# EAGLE schematic touch-board-ks-edition (EAGLE 6.5.0)
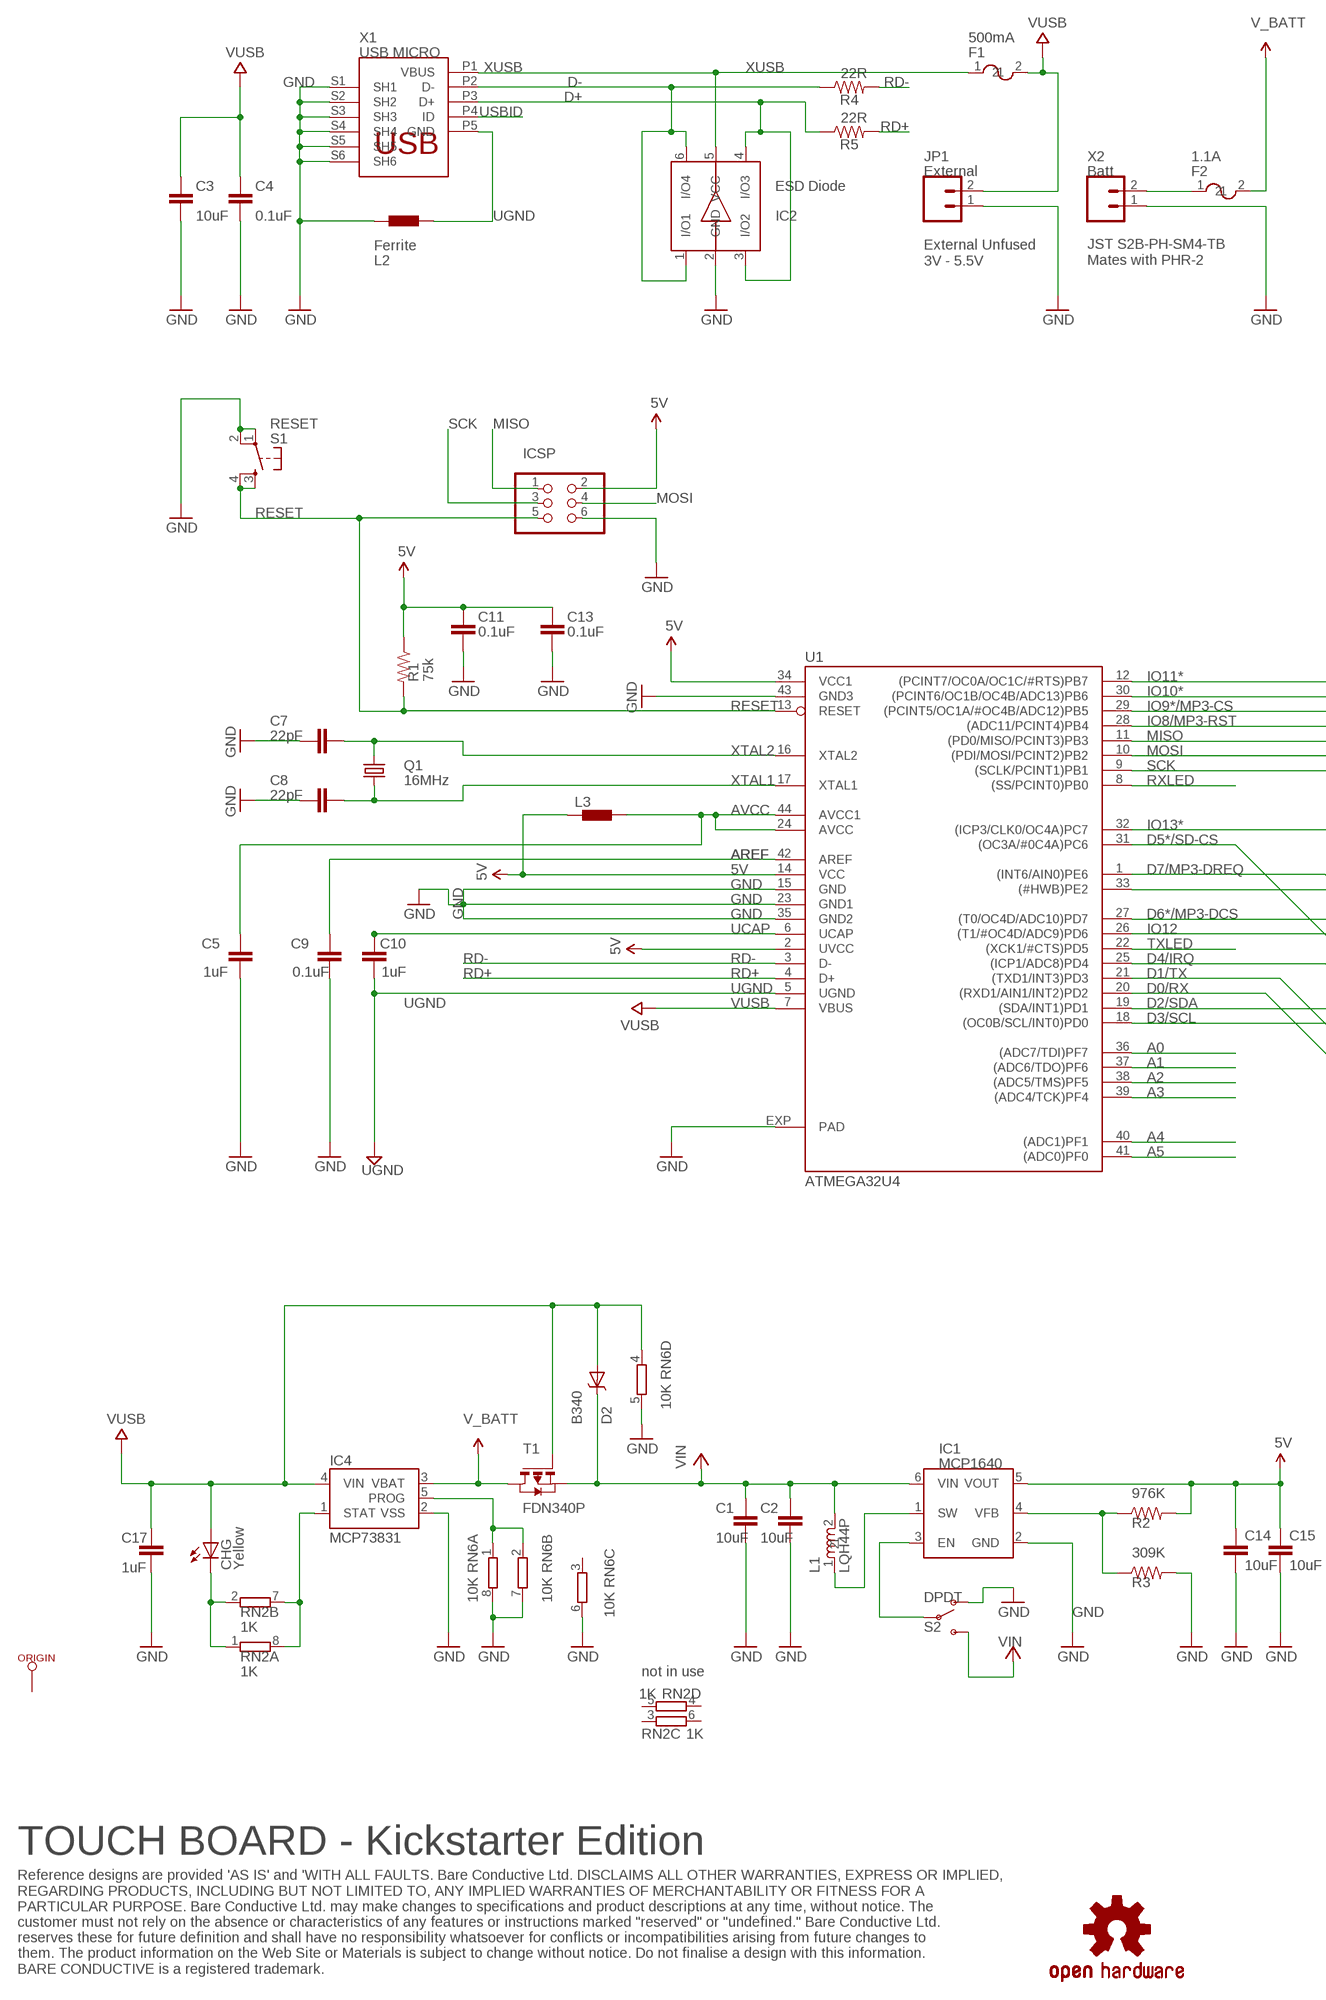
[diagram p0: schematic, sheet 1, part 1 of 2]
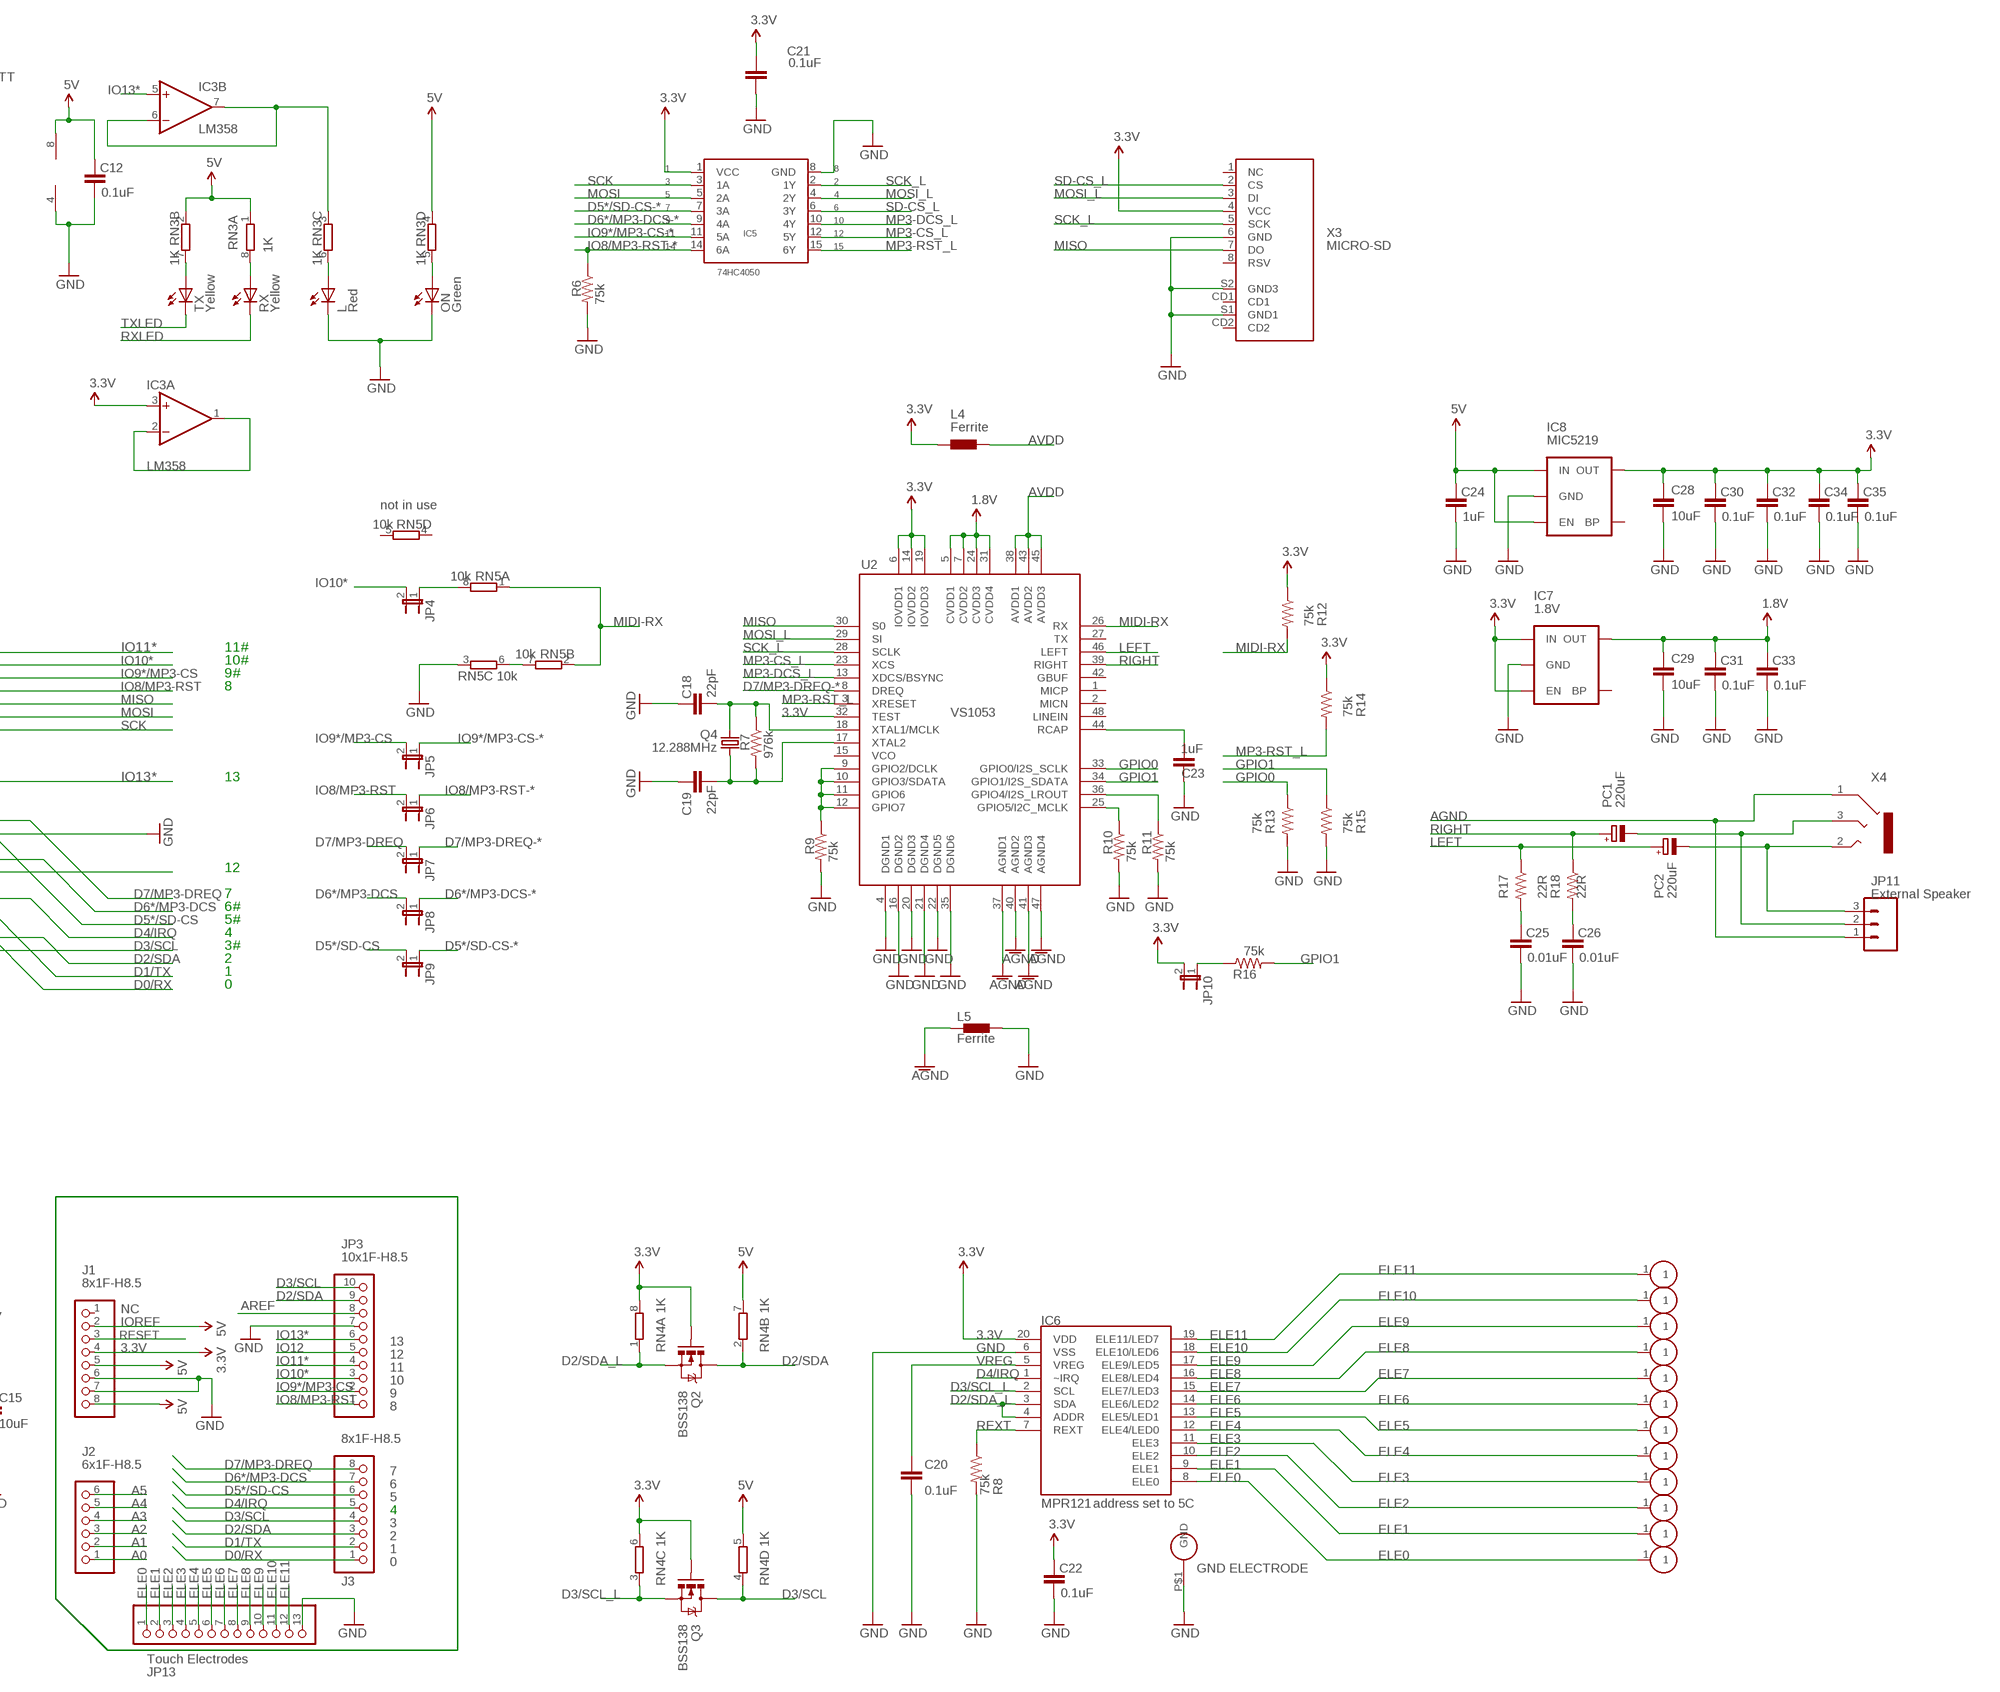
[diagram p1: schematic, sheet 1, part 2 of 2]

## Parts
C1  10uF  CAP1206  [1206]
C2  10uF  CAP1206  [1206]
C3  10uF  CAP1206  [1206]
C4  0.1uF  CAP0402-CAP  [0402-CAP]
C5  1uF  CAP0402-CAP  [0402-CAP]
C7  22pF  CAP0402-CAP  [0402-CAP]
C8  22pF  CAP0402-CAP  [0402-CAP]
C9  0.1uF  CAP0402-CAP  [0402-CAP]
C10  1uF  CAP0402-CAP  [0402-CAP]
C11  0.1uF  CAP0402-CAP  [0402-CAP]
C12  0.1uF  CAP0402-CAP  [0402-CAP]
C13  0.1uF  CAP0402-CAP  [0402-CAP]
C14  10uF  CAP1206  [1206]
C15  10uF  CAP1206  [1206]
C17  1uF  CAP0402-CAP  [0402-CAP]
C18  22pF  CAP0402-CAP  [0402-CAP]
C19  22pF  CAP0402-CAP  [0402-CAP]
C20  0.1uF  CAP0402-CAP  [0402-CAP]
C21  0.1uF  CAP0402-CAP  [0402-CAP]
C22  0.1uF  CAP0402-CAP  [0402-CAP]
C23  1uF  CAP0402-CAP  [0402-CAP]
C24  1uF  CAP0402-CAP  [0402-CAP]
C25  0.01uF  CAP0402-CAP  [0402-CAP]
C26  0.01uF  CAP0402-CAP  [0402-CAP]
C28  10uF  CAP1206  [1206]
C29  10uF  CAP1206  [1206]
C30  0.1uF  CAP0402-CAP  [0402-CAP]
C31  0.1uF  CAP0402-CAP  [0402-CAP]
C32  0.1uF  CAP0402-CAP  [0402-CAP]
C33  0.1uF  CAP0402-CAP  [0402-CAP]
C34  0.1uF  CAP0402-CAP  [0402-CAP]
C35  0.1uF  CAP0402-CAP  [0402-CAP]
CHG  Yellow  LEDCHIPLED_0805  [CHIPLED_0805]
D2  B340  DIODE-SCHOTTKY_  [SMA-DIODE]
F1  500mA  PTC  [0805]
F2  1.1A  PTC  [0805]
IC1  MCP1640  BOOST-REG  [6-LEAD-SOT23]
IC2  ESD Diode  PRTR5V  [SOT457]
IC3  LM358  LMV358MMX  [MSOP08]
IC4  MCP73831  [SOT23-5]
IC5  74HC4050  74HC4050PW  [TSSOP-16]
IC6  MPR121  MPR121QFN20  [QFN-20-0.4MM]
IC7  1.8V  V_REG_LDOSMD2  [SC70]
IC8  MIC5219  V_REG_LDOSMD  [SOT23-5]
ICSP  ICSP  PINHD-2X3  [2X03]
J1  8x1F-H8.5  PINHD-1X8  [1X08]
J2  6x1F-H8.5  PINHD-1X6  [1X06]
J3  8x1F-H8.5  PINHD-1X8  [1X08]
JP1  External  M02PTH  [1X02]
JP3  10x1F-H8.5  PINHD-1X10  [1X10]
JP4  JUMPER-2SMD-NO  [SJ_2S-NO]
JP5  JUMPER-2SMD-NC  [SJ_2S]
JP6  JUMPER-2SMD-NC  [SJ_2S]
JP7  JUMPER-2SMD-NC  [SJ_2S]
JP8  JUMPER-2SMD-NC  [SJ_2S]
JP9  JUMPER-2SMD-NC  [SJ_2S]
JP10  JUMPER-2SMD-NO  [SJ_2S-NO]
JP11  External Speaker  M03PTH  [1X03]
JP13  Touch Electrodes  PINHD-1X13  [1X13]
L  Red  LEDCHIPLED_0805  [CHIPLED_0805]
L1  LQH44P  [LQH44PN100MP0L]
L2  Ferrite  BLM15HB121SN1  [0402]
L3  BLM15HB121SN1  [0402]
L4  Ferrite  BLM15HB121SN1  [0402]
L5  Ferrite  BLM15HB121SN1  [0402]
ON  Green  LEDCHIPLED_0805  [CHIPLED_0805]
ORIGIN  TP_SP  [TP-SP]
PC1  220uF  CPOL-EUD  [PANASONIC_D]
PC2  220uF  CPOL-EUD  [PANASONIC_D]
Q1  16MHz  CRYSTAL5X3  [CRYSTAL-SMD-5X3]
Q2  BSS138  MOSFET-NCHANNELSMD  [SOT23-3]
Q3  BSS138  MOSFET-NCHANNELSMD  [SOT23-3]
Q4  12.288MHz  CRYSTAL5X3  [CRYSTAL-SMD-5X3]
R1  75k  RESISTOR0402-RES  [0402-RES]
R2  976K  RESISTOR0402-RES  [0402-RES]
R3  309K  RESISTOR0402-RES  [0402-RES]
R4  22R  RESISTOR0402-RES  [0402-RES]
R5  22R  RESISTOR0402-RES  [0402-RES]
R6  75k  RESISTOR0402-RES  [0402-RES]
R7  976k  RESISTOR0402-RES  [0402-RES]
R8  75k  RESISTOR0402-RES  [0402-RES]
R9  75k  RESISTOR0402-RES  [0402-RES]
R10  75k  RESISTOR0402-RES  [0402-RES]
R11  75k  RESISTOR0402-RES  [0402-RES]
R12  75k  RESISTOR0402-RES  [0402-RES]
R13  75k  RESISTOR0402-RES  [0402-RES]
R14  75k  RESISTOR0402-RES  [0402-RES]
R15  75k  RESISTOR0402-RES  [0402-RES]
R16  75k  RESISTOR0402-RES  [0402-RES]
R17  22R  RESISTOR0402-RES  [0402-RES]
R18  22R  RESISTOR0402-RES  [0402-RES]
RN2  1K  4R-NCAY16  [CAY16]
RN3  1K  4R-NCAY16  [CAY16]
RN4  1K  4R-NCAY16  [CAY16]
RN5  10k  4R-NCAY16  [CAY16]
RN6  10K  4R-NCAY16  [CAY16]
RX  Yellow  LEDCHIPLED_0805  [CHIPLED_0805]
S1  RESET  TAC_SWITCHSND  [TACTILE_SWITCH_SMD@1]
S2  DPDT  DPDT-SWITCH  [JS202011SCQN]
T1  FDN340P  PMOSSOT23  [SOT-23]
TX  Yellow  LEDCHIPLED_0805  [CHIPLED_0805]
U1  ATMEGA32U4  ATMEGA32U4-XUMU  [QFN44ML7X7]
U2  VS1053  VS1033  [LQFP-48]
U$1  EDGE-ELEC-LEFT  [EDGE-ELEC-LEFT]
U$3  EDGE-ELEC-RIGHT  [EDGE-ELEC-RIGHT]
U$6  EDGE-GND  [EDGE-GND]
U$8  OSHW-LOGO  [OSHW-LOGO]
U$17  EDGE-ELEC  [EDGE-ELEC]
U$18  EDGE-ELEC  [EDGE-ELEC]
U$22  EDGE-ELEC  [EDGE-ELEC]
U$24  EDGE-ELEC  [EDGE-ELEC]
U$26  EDGE-ELEC  [EDGE-ELEC]
U$27  EDGE-ELEC  [EDGE-ELEC]
U$28  EDGE-ELEC  [EDGE-ELEC]
U$29  EDGE-ELEC  [EDGE-ELEC]
U$30  EDGE-ELEC  [EDGE-ELEC]
U$31  EDGE-ELEC  [EDGE-ELEC]
X1  USB MICRO  MYCON2_USB-MINI-B  [CON2_USB_MICRO_B_AT]
X2  Batt  M02-JST-2MM-SMT  [JST-2-SMD]
X3  MICRO-SD  TOBY-SD  [MSDC-PP-02]
X4  SJ-3523  [3POLE-JACK]

## Nets
1.8V: C29.1 C31.2 C33.2 IC7.5(OUT) U2.5(CVDD1) U2.7(CVDD2) U2.24(CVDD3) U2.31(CVDD4)
3.3V: C21.2 C22.2 C28.1 C30.2 C32.2 C34.2 C35.2 IC3.3(A:+IN) IC5.1(VCC) IC6.20(VDD) IC7.1(IN) IC7.3(EN) IC8.5(OUT) J1.4 JP10.2 L4.1 Q2.1(G) Q3.1(G) R12.1 R14.1 RN4.6 RN4.8 U2.6(IOVDD1) U2.14(IOVDD2) U2.19(IOVDD3) U2.32(TEST) X3.4(VCC)
5V: C11.2 C12.2 C13.2 C14.1 C15.1 C24.2 IC1.5(VOUT) IC3.8(P:V+) IC8.1(IN) IC8.3(EN) ICSP.2 J1.2 J1.5 J1.8 L3.1 R1.1 R2.2 RN3.1 RN3.2 RN3.4 RN4.5 RN4.7 U1.2(UVCC) U1.14(VCC) U1.34(VCC1)
A0: J2.1 U1.36((ADC7/TDI)PF7)
A1: J2.2 U1.37((ADC6/TDO)PF6)
A2: J2.3 U1.38((ADC5/TMS)PF5)
A3: J2.4 U1.39((ADC4/TCK)PF4)
A4: J2.5 U1.40((ADC1)PF1)
A5: J2.6 U1.41((ADC0)PF0)
AGND: JP11.1 L5.1 U2.37(AGND1) U2.40(AGND2) U2.41(AGND3) U2.47(AGND4) X4.1
AREF [aref]: C9.2 JP3.8 U1.42(AREF)
AVCC: C5.2 L3.2 U1.24(AVCC) U1.44(AVCC1)
AVDD: L4.2 U2.38(AVDD1) U2.43(AVDD2) U2.45(AVDD3)
D0/RX: J3.1 U1.20((RXD1/AIN1/INT2)PD2)
D1/TX: J3.2 U1.21((TXD1/INT3)PD3)
D2/SDA: J3.3 JP3.9 Q2.3(D) RN4.2 U1.19((SDA/INT1)PD1)
D2/SDA_L: IC6.3(SDA) IC6.4(ADDR) Q2.2(S) RN4.1
D3/SCL: J3.4 JP3.10 Q3.3(D) RN4.4 U1.18((OC0B/SCL/INT0)PD0)
D3/SCL_L: IC6.2(SCL) Q3.2(S) RN4.3
D4/IRQ: IC6.1(~IRQ) J3.5 U1.25((ICP1/ADC8)PD4)
D5*/SD-CS: J3.6 JP9.2 U1.31((OC3A/#0C4A)PC6)
D5*/SD-CS-*: IC5.7(3A) JP9.1
D6*/MP3-DCS: J3.7 JP8.2 U1.27((T0/OC4D/ADC10)PD7)
D6*/MP3-DCS-*: IC5.9(4A) JP8.1
D7/MP3-DREQ: J3.8 JP7.2 U1.1((INT6/AIN0)PE6)
D7/MP3-DREQ-*: JP7.1 U2.8(DREQ)
D+: IC2.3(I/O2) IC2.4(I/O3) R5.1 X1.P3(D+)
D-: IC2.1(I/O1) IC2.6(I/O4) R4.1 X1.P2(D-)
ELE0: IC6.8(ELE0) JP13.1 U$1.1
ELE1: IC6.9(ELE1) JP13.2 U$31.1
ELE2: IC6.10(ELE2) JP13.3 U$30.1
ELE3: IC6.11(ELE3) JP13.4 U$29.1
ELE4: IC6.12(ELE4/LED0) JP13.5 U$28.1
ELE5: IC6.13(ELE5/LED1) JP13.6 U$27.1
ELE6: IC6.14(ELE6/LED2) JP13.7 U$26.1
ELE7: IC6.15(ELE7/LED3) JP13.8 U$24.1
ELE8: IC6.16(ELE8/LED4) JP13.9 U$22.1
ELE9: IC6.17(ELE9/LED5) JP13.10 U$18.1
ELE10: IC6.18(ELE10/LED6) JP13.11 U$17.1
ELE11: IC6.19(ELE11/LED7) JP13.12 U$3.1
G1: R9.1 U2.9(GPIO2/DCLK) U2.10(GPIO3/SDATA) U2.11(GPIO6) U2.12(GPIO7)
G2: R10.1 U2.25(GPIO5/I2C_MCLK)
GND [gnd]: C1.2 C2.2 C3.2 C4.1 C5.1 C7.2 C8.2 C9.1 C11.1 C12.1 C13.1 C14.2 C15.2 C17.1 C18.2 C19.2 C20.1 C21.1 C22.1 C23.2 C24.1 C25.1 C26.1 C28.2 C29.2 C30.1 C31.1 C32.1 C33.1 C34.1 C35.1 IC1.2(GND) IC2.2(GND) IC3.4(P:V-) IC4.2(VSS) IC5.8(GND) IC6.6(VSS) IC7.2(GND) IC8.2(GND) ICSP.6 J1.6 J1.7 JP1.1 JP3.7 JP13.13 L2.1 L5.2 L.C ON.C R3.2 R6.2 R8.2 R9.2 R10.2 R11.2 R13.2 R15.2 RN5.3 RN6.5 RN6.6 RN6.7 RN6.8 S1.1 S1.2 S2.4 U1.15(GND) U1.23(GND1) U1.33((#HWB)PE2) U1.35(GND2) U1.43(GND3) U1.EXP(PAD) U2.4(DGND1) U2.16(DGND2) U2.20(DGND3) U2.21(DGND4) U2.22(DGND5) U2.35(DGND6) U$6.P$1(GND) X1.S1(SH1) X1.S2(SH2) X1.S3(SH3) X1.S4(SH4) X1.S5(SH5) X1.S6(SH6) X2.1 X3.6(GND) X3.S1(GND1) X3.S2(GND3)
GPIO0: R13.1 U2.33(GPIO0/I2S_SCLK)
GPIO1: R15.1 R16.2 U2.34(GPIO1/I2S_SDATA)
IO8/MP3-RST: JP3.1 JP6.2 U1.28((ADC11/PCINT4)PB4)
IO8/MP3-RST-*: IC5.14(6A) JP6.1 R6.1
IO9*/MP3-CS: JP3.2 JP5.2 U1.29((PCINT5/OC1A/#OC4B/ADC12)PB5)
IO9*/MP3-CS-*: IC5.11(5A) JP5.1
IO10*: JP3.3 JP4.2 U1.30((PCINT6/OC1B/OC4B/ADC13)PB6)
IO11*: JP3.4 U1.12((PCINT7/OC0A/OC1C/#RTS)PB7)
IO12: JP3.5 U1.26((T1/#OC4D/ADC9)PD6)
IO13*: IC3.5(B:+IN) JP3.6 U1.32((ICP3/CLK0/OC4A)PC7)
LEFT: PC2.+ R17.1 U2.46(LEFT)
MIDI-RX: R12.2 RN5.1 RN5.2 U2.26(RX)
MISO: ICSP.1 U1.11((PD0/MISO/PCINT3)PB3) U2.30(S0) X3.7(DO)
MOSI: IC5.5(2A) ICSP.4 U1.10((PDI/MOSI/PCINT2)PB2)
MOSI_L: IC5.4(2Y) U2.29(SI) X3.3(DI)
MP3-CS_L: IC5.12(5Y) U2.23(XCS)
MP3-DCS_L: IC5.10(4Y) U2.13(XDCS/BSYNC)
MP3-RST_L: IC5.15(6Y) R14.2 U2.3(XRESET)
N$1: IC3.6(B:-IN) IC3.7(B:OUT) RN3.3
N$2: L.A RN3.6
N$3: RN3.7 TX.A
N$4 [gnd]: IC4.1(STAT) RN2.7 RN2.8
N$5: C23.1 U2.44(RCAP)
N$6: RN3.8 RX.A
N$8: ON.A RN3.5
N$9: C18.1 Q4.3 R7.1 U2.18(XTAL1/MCLK)
N$10: C19.1 Q4.1 R7.2 U2.17(XTAL2)
N$11: IC1.1(SW) L1.1
N$12: IC1.4(VFB) R2.1 R3.1
N$13: F2.1 X2.2
N$14: JP4.1 RN5.8
N$15: IC3.1(A:OUT) IC3.2(A:-IN)
N$19: IC4.5(PROG) RN6.1 RN6.2
N$21: C25.2 R17.2
N$22: C26.2 R18.2
N$23: IC1.3(EN) S2.5
N$24: JP11.3 PC2.- X4.2
N$25: JP10.1 R16.1
N$26: JP11.2 PC1.- X4.3
N$27: RN5.6 RN5.7
N$32: CHG.C RN2.1 RN2.2
N$73: R11.1 U2.36(GPIO4/I2S_LROUT)
RD+: R5.2 U1.4(D+)
RD-: R4.2 U1.3(D-)
RESET: ICSP.5 J1.3 R1.2 S1.3 S1.4 U1.13(RESET)
REXT: IC6.7(REXT) R8.1
RIGHT: PC1.+ R18.1 U2.39(RIGHT)
RXLED: RX.C U1.8((SS/PCINT0)PB0)
SCK: IC5.3(1A) ICSP.3 U1.9((SCLK/PCINT1)PB1)
SCK_L: IC5.2(1Y) U2.28(SCLK) X3.5(SCK)
SD-CS_L: IC5.6(3Y) X3.2(CS)
TXLED: TX.C U1.22((XCK1/#CTS)PD5)
UCAP: C10.2 U1.6(UCAP)
UGND [gnd]: C10.1 L2.2 U1.5(UGND) X1.P5(GND)
USBID: X1.P4(ID)
V_BATT: F2.2 IC4.3(VBAT) T1.1(D)
VCC: C1.1 C2.1 D2.C IC1.6(VIN) L1.2 S2.6 T1.2(S) ; supply symbol labelled VIN
VREG: C20.2 IC6.5(VREG)
VUSB: C3.1 C4.2 C17.2 CHG.A D2.A F1.2 IC4.4(VIN) JP1.2 RN6.4 T1.3(G) U1.7(VBUS)
XTAL1: C8.1 Q1.1 U1.17(XTAL1)
XTAL2: C7.1 Q1.3 U1.16(XTAL2)
XUSB [usbvcc]: F1.1 IC2.5(VCC) X1.P1(VBUS)
Unconnected: IC7.4(BP) IC8.4(BP) J1.1 ORIGIN.X(TESTP) RN2.3 RN2.4 RN2.5 RN2.6 RN5.4 RN5.5 RN6.3 U2.1(MICP) U2.2(MICN) U2.15(VCO) U2.27(TX) U2.42(GBUF) U2.48(LINEIN) X3.1(NC) X3.8(RSV) X3.CD1 X3.CD2

## Notes on the sheet
- USB
- External Unfused
  3V - 5.5V
- JST S2B-PH-SM4-TB
  Mates with PHR-2
- not in use
- 11#
- 10#
- 9#
- 8
- 13
- 12
- 7
- 6#
- 5#
- 4
- 3#
- 2
- 1
- 0
- NC
- IOREF
- 13
- 12
- 11
- 10
- 9
- 8
- 7
- 6
- 5
- address set to 5C
- 4
- not in use
- 3
- 2
- 1
- 0
- GND ELECTRODE
- TOUCH BOARD - Kickstarter Edition
- Reference designs are provided 'AS IS' and 'WITH ALL FAULTS. Bare Conductive Ltd. DISCLAIMS ALL OTHER WARRANTIES, EXPRESS OR IMPLIED,
  REGARDING PRODUCTS, INCLUDING BUT NOT LIMITED TO, ANY IMPLIED WARRANTIES OF MERCHANTABILITY OR FITNESS FOR A 
  PARTICULAR PURPOSE. Bare Conductive Ltd. may make changes to specifications and product descriptions at any time, without notice. The 
  customer must not rely on the absence or characteristics of any features or instructions marked "reserved" or "undefined." Bare Conductive Ltd.
  reserves these for future definition and shall have no responsibility whatsoever for conflicts or incompatibilities arising from future changes to 
  them. The product information on the Web Site or Materials is subject to change without notice. Do not finalise a design with this information.
  BARE CONDUCTIVE is a registered trademark.

## Library data of the parts
C1-C3 C14 C15 C28 C29 = SparkFun-Capacitors:CAP: Capacitor Standard 0603 ceramic capacitor, and 0.1" leaded capacitor.
C4 C5 C7-C13 C17-C26 C30-C35 = SparkFun:CAP: Capacitor Standard 0603 ceramic capacitor, and 0.1" leaded capacitor.
CHG L ON RX TX = led:LED: LED OSRAM: - CHIPLED LG R971, LG N971, LY N971, LG Q971, LY Q971, LO R971, LY R971 LH N974, LH R974 LS Q976, LO Q976, LY Q976 LO Q996 - Hyper CHIPLED LW Q18S LB Q993, LB Q99A, LB R99A - SideLED LS A670, LO A670, LY A670, LG A670, LP A670 LB A673, LV A673, LT A673, LW A673 LH A674 LY A675 LS A676, LA A676, LO A676, LY A676, LW A676 LS A679, LY A679, LG A679 - Hyper Micro SIDELED® LS Y876, LA Y876, LO Y876, LY Y876 LT Y87S - SmartLED LW L88C, LW L88S LB L89C, LB L89S, LG L890 LS L89K, LO L89K, LY L89K LS L896, LA L896, LO L896, LY L896 - TOPLED LS T670, LO T670, LY T670, LG T670, LP T670 LSG T670, LSP T670, LSY T670, LOP T670, LYG T670 LG T671, LOG T671, LSG T671 LB T673, LV T673, LT T673, LW T673 LH T674 LS T676, LA T676, LO T676, LY T676, LB T676, LH T676, LSB T676, LW T676 LB T67C, LV T67C, LT T67C, LS T67K, LO T67K, LY T67K, LW E67C LS E67B, LA E67B, LO E67B, LY E67B, LB E67C, LV E67C, LT E67C LW T67C LS T679, LY T679, LG T679 LS T770, LO T770, LY T770, LG T770, LP T770 LB T773, LV T773, LT T773, LW T773 LH T774 LS E675, LA E675, LY E675, LS T675 LS T776, LA T776, LO T776, LY T776, LB T776 LHGB T686 LT T68C, LB T68C - Hyper Mini TOPLED® LB M676 - Mini TOPLED Santana® LG M470 LS M47K, LO M47K, LY M47K Source: http://www.osram.convergy.de LUXEON: - LUMILED® LXK2-PW12-R00, LXK2-PW12-S00, LXK2-PW14-U00, LXK2-PW14-V00 LXK2-PM12-R00, LXK2-PM12-S00, LXK2-PM14-U00 LXK2-PE12-Q00, LXK2-PE12-R00, LXK2-PE12-S00, LXK2-PE14-T00, LXK2-PE14-U00 LXK2-PB12-K00, LXK2-PB12-L00, LXK2-PB12-M00, LXK2-PB14-N00, LXK2-PB14-P00, LXK2-PB14-Q00 LXK2-PR12-L00, LXK2-PR12-M00, LXK2-PR14-Q00, LXK2-PR14-R00 LXK2-PD12-Q00, LXK2-PD12-R00, LXK2-PD12-S00 LXK2-PH12-R00, LXK2-PH12-S00 LXK2-PL12-P00, LXK2-PL12-Q00, LXK2-PL12-R00 Source: www.luxeon.com KINGBRIGHT: KA-3528ASYC Source: www.kingbright.com
D2 = SparkFun-DiscreteSemi:DIODE-SCHOTTKY: Commonly MBRA140.; PROD_ID: DIO-09886
F1 F2 = BareConductive:PTC: PTC FUSE 0805
IC1 = BareConductive:BOOST-REG: 0.65V Start-up Synchronous Boost Regulator MCP1640
IC2 = BareConductive:PRTR5V: ESD DIODE
IC3 = linear:LMV358?*: Dual General Purpose, Low Voltage, Rail-to-Rail Output Operational Amplifiers Source: http://www.national.com/mpf/LM/LMV321.html http://www.national.com/dt/lmv_qual.pdf
IC4 = SparkFun:MCP73831: Microchip's MCP73831 Miniature single cell, fully integrated Li-Ion, Li-polymer charge management controller http://ww1.microchip.com/downloads/en/DeviceDoc/21984a.pdf
IC5 = BareConductiveLbr:74HC4050PW
IC6 = SparkFun:MPR121: MPR121 Capacitive Touch Sensor Controller
IC7 IC8 = SparkFun:V_REG_LDO: Voltage Regulator LDO Standard 150mA LDO voltage regulator in SOT-23 layout. Micrel part MIC5205. BP (by-pass) pin is used to lower output noise with 470pF cap.
ICSP = SmartPrj:PINHD-2X3: PIN HEADER
J1 J3 = SmartPrj:PINHD-1X8: PIN HEADER
J2 = SmartPrj:PINHD-1X6: PIN HEADER
JP1 X2 = SparkFun:M02: Header 2 Standard 2-pin 0.1" header. Use with straight break away headers (SKU : PRT-00116), right angle break away headers (PRT-00553), swiss pins (PRT-00743), machine pins (PRT-00117), and female headers (PRT-00115). Molex polarized connector foot print use with SKU : PRT-08233 with associated crimp pins and housings.
JP3 = SmartPrj:PINHD-1X10: PIN HEADER
JP4-JP10 = SparkFun-Passives:JUMPER-2: Jumper Basic 0.1" spaced jumper. Use with breakaway headers.
JP11 = SparkFun:M03: Header 3 Standard 3-pin 0.1" header. Use with straight break away headers (SKU : PRT-00116), right angle break away headers (PRT-00553), swiss pins (PRT-00743), machine pins (PRT-00117), and female headers (PRT-00115). Molex polarized connector foot print use with SKU : PRT-08232 with associated crimp pins and housings.
JP13 = pinhead:PINHD-1X13: PIN HEADER
L1 = BareConductive:LQH44P: LQH44P CHIP INDUCTOR
L2-L5 = inductors:BLM15H: EMIFIL (R) Chip Ferrite Bead for GHz Noise Source: http://www.murata.com/ Ferrite Bead BLM15H.pdf
ORIGIN = SmartPrj:TP_SP
PC1 PC2 = rcl:CPOL-EU: POLARIZED CAPACITOR, European symbol
Q1 Q4 = SparkFun:CRYSTAL: Crystals Various standard crystals. Proven footprints. Spark Fun Electronics SKU : COM-00534
Q2 Q3 = SparkFun:MOSFET-NCHANNEL
R1-R18 = SparkFun:RESISTOR: Resistor Basic schematic elements and footprints for 0603, 1206, and PTH resistors.
RN2-RN6 = resistor-dil:4R-N: Array Chip Resistor Source: RS Component / Phycomp
S1 = SparkFun:TAC_SWITCH: Momentary Switch Button commonly used for reset or general input. Spark Fun Electronics SKU : COM-00097
S2 = BareConductive:DPDT-SWITCH: JS202011SCQN SLIDE SWITCH
T1 = zetex:PMOSSOT23: MOS FET
U1 = SmartPrj:ATMEGA32U4-XU
U2 = SparkFun:VS1033
U$1 = BareConductiveLbr:EDGE-ELEC-LEFT
U$3 = BareConductiveLbr:EDGE-ELEC-RIGHT
U$6 = BareConductiveLbr:EDGE-GND
U$8 = BareConductive:OSHW-LOGO
U$17 U$18 U$22 U$24 U$26-U$31 = BareConductiveLbr:EDGE-ELEC
X1 = SmartPrj:MYCON2_USB-MINI-B
X3 = BareConductive:TOBY-SD: TOBY MICRO SD CARD HOLDER
X4 = BareConductive:SJ-3523

## Net classes
1 power: width 0.254 mm, drill 0.61 mm, clearance 0.254 mm
2 gnd: width 0.254 mm, drill 0.61 mm, clearance 0.254 mm
3 usbvcc: width 0.254 mm, drill 0.61 mm, clearance 0.254 mm
4 aref: width 0.254 mm, drill 0.61 mm, clearance 0.254 mm